# Altium schematic sheet ext_abdoard.SchDoc
size A4; SheetNumber: 1; SheetTotal: 1
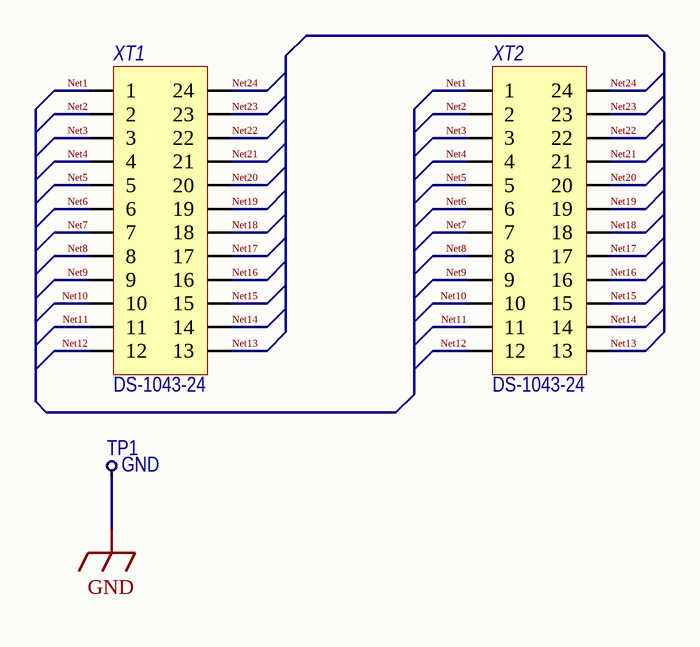
[diagram p0: ext_abdoard.SchDoc]

## Parts
TP1  GND  [TestPoint]
XT1  DS-1043-24  [DS-1043-24]
XT2  DS-1043-24  [DS-1043-24]

## Nets
GND: TP1.0(TP)
Net1: XT1.1 XT2.1
Net2: XT1.2 XT2.2
Net3: XT1.3 XT2.3
Net4: XT1.4 XT2.4
Net5: XT1.5 XT2.5
Net6: XT1.6 XT2.6
Net7: XT1.7 XT2.7
Net8: XT1.8 XT2.8
Net9: XT1.9 XT2.9
Net10: XT1.10 XT2.10
Net11: XT1.11 XT2.11
Net12: XT1.12 XT2.12
Net13: XT1.13 XT2.13
Net14: XT1.14 XT2.14
Net15: XT1.15 XT2.15
Net16: XT1.16 XT2.16
Net17: XT1.17 XT2.17
Net18: XT1.18 XT2.18
Net19: XT1.19 XT2.19
Net20: XT1.20 XT2.20
Net21: XT1.21 XT2.21
Net22: XT1.22 XT2.22
Net23: XT1.23 XT2.23
Net24: XT1.24 XT2.24

## Library data of the parts
TP1 = TP: Наименование: Точка проверки; Назначение: Контроль параметров платы; TP_Name: GND
XT1 XT2 = DS-1043-24: DIP-24 Zero Insertion Force (ZIF) socket; Назначение: Панель с нулевым усилием (ZIF) для DIP-24; Наименование: DS-1043-24